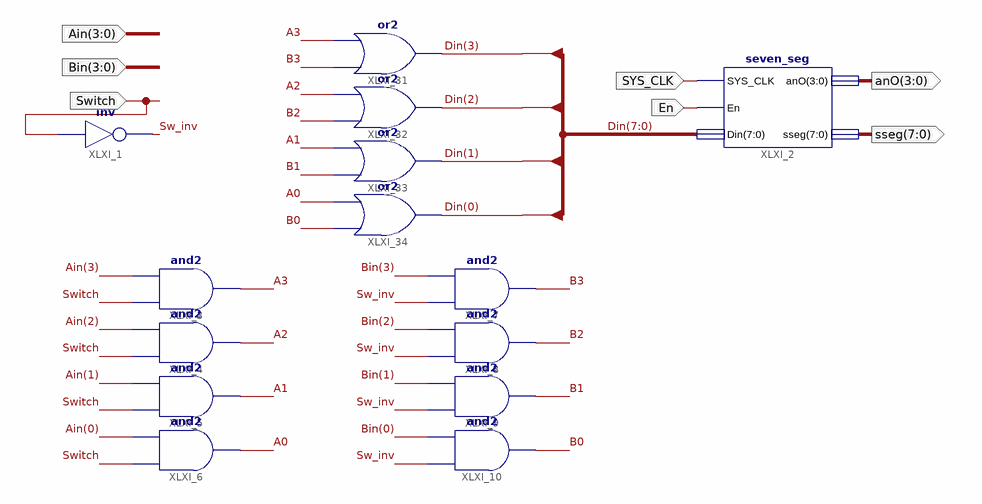
[diagram p0: schematic sheet 1]
// Xilinx ISE schematic Lab6_Ex5.sch (spartan3e) as structural Verilog: 14 symbols, 7 ports
module Lab6_Ex5 (
  input  [3:0] Ain,
  input  [3:0] Bin,
  input  Switch,
  input  En,
  input  SYS_CLK,
  output [3:0] anO,
  output [7:0] sseg
);

  wire A0, A1, A2, A3, B0, B1, B2, B3, Sw_inv;
  wire [7:0] Din;

  not XLXI_1 (Sw_inv, Switch);
  seven_seg XLXI_2 (.SYS_CLK(SYS_CLK), .En(En), .Din(Din), .anO(anO), .sseg(sseg));
  and XLXI_3 (A3, Switch, Ain[3]);
  and XLXI_4 (A2, Switch, Ain[2]);
  and XLXI_5 (A1, Switch, Ain[1]);
  and XLXI_6 (A0, Switch, Ain[0]);
  and XLXI_7 (B3, Sw_inv, Bin[3]);
  and XLXI_8 (B2, Sw_inv, Bin[2]);
  and XLXI_9 (B1, Sw_inv, Bin[1]);
  and XLXI_10 (B0, Sw_inv, Bin[0]);
  or XLXI_31 (Din[3], B3, A3);
  or XLXI_32 (Din[2], B2, A2);
  or XLXI_33 (Din[1], B1, A1);
  or XLXI_34 (Din[0], B0, A0);
endmodule
